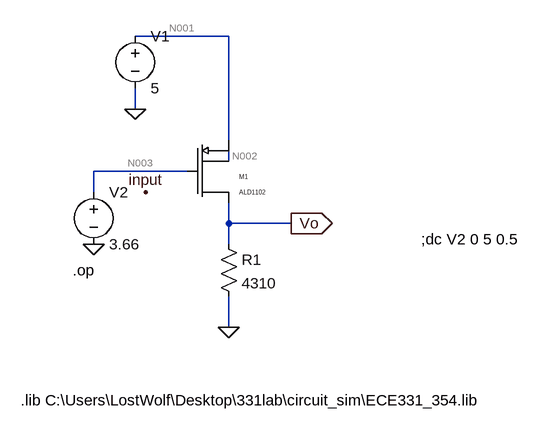
[diagram p0: schematic lab1_pmos.asc]
lab1_pmos.asc, the LTspice schematic file:
Version 4
SHEET 1 880 680
WIRE 176 -208 32 -208
WIRE 32 -96 32 -128
WIRE 176 -48 176 -208
WIRE 176 -16 176 -32
WIRE 112 0 -32 0
WIRE -32 32 -32 0
WIRE 176 80 176 48
WIRE 272 80 176 80
WIRE 176 112 176 80
WIRE 176 240 176 192
FLAG 176 240 0
FLAG 32 -96 0
FLAG 48 32 input
FLAG -32 112 0
FLAG 272 80 Vo
IOPIN 272 80 Out
SYMBOL voltage 32 -224 R0
WINDOW 123 0 0 Left 2
WINDOW 39 0 0 Left 2
SYMATTR InstName V1
SYMATTR Value 5
SYMBOL voltage -32 16 R0
WINDOW 123 0 0 Left 2
WINDOW 39 0 0 Left 2
SYMATTR InstName V2
SYMATTR Value 3.66
SYMBOL ALD1102 112 -48 R0
SYMATTR InstName M1
SYMBOL res 160 96 R0
SYMATTR InstName R1
SYMATTR Value 4310
TEXT -64 152 Left 2 !.op
TEXT -144 352 Left 2 !.lib C:\\Users\\LostWolf\\Desktop\\331lab\\circuit_sim\\ECE331_354.lib
TEXT 472 104 Left 2 !;dc V2 0 5 0.5

The netlist it stands for:
* lab1_pmos.asc
V1 N001 0 5
V2 N003 0 3.66
M1 Vo N003 N001 N002 ALD1102 W=1.739e-3 L=1e-6
R1 Vo 0 4310
.model NMOS NMOS
.model PMOS PMOS
.lib standard.mos
.op
.lib C:\Users\LostWolf\Desktop\331lab\circuit_sim\ECE331_354.lib
;dc V2 0 5 0.5
.backanno
.end

* Results of the author's LTspice run, read from the files saved beside the schematic
* Operating Point:
*   V(n001) = 5 V
*   V(n003) = 3.66 V
*   V(vo) = 2.734 V
*   V(n002) = 4.826 V
*   Id(M1) = -634.4 µA
*   Ig(M1) = 0 A
*   Ib(M1) = -4.826 pA
*   Is(M1) = 634.4 µA
*   I(R1) = 634.4 µA
*   I(V2) = 0 A
*   I(V1) = -634.4 µA
* From the log:
*   Semiconductor Device Operating Points:
*                           --- MOSFET Transistors ---
*   Name:          m1
*   Model:       ald1102
*   Id:         -6.34e-04
*   Vgs:        -1.34e+00
*   Vds:        -2.27e+00
*   Vbs:        -1.74e-01
*   Vth:        -7.17e-01
*   Vdsat:      -4.88e-01
*   Gm:          1.57e-03
*   Gds:         3.49e-05
*   Gmb:         6.77e-04
*   Cbd:         0.00e+00
*   Cbs:         0.00e+00
*   Cgsov:       2.00e-12
*   Cgdov:       2.00e-12
*   Cgbov:       0.00e+00
*   Cgs:         4.00e-12
*   Cgd:         0.00e+00
*   Cgb:         0.00e+00